# Altium schematic sheet RIGHT.SchDoc
size A4; SheetNumber: 3; SheetTotal: 7
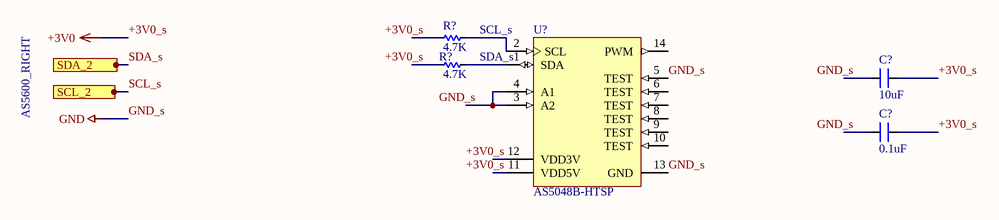
[diagram p0: RIGHT.SchDoc]

## Parts
(Parts that share a designator on the sheet are numbered #1, #2 ... from top to bottom, then left to right.)
C?#1  10uF  [C-SE-7,5x10x9x5x4]
C?#2  0.1uF  [C-SE-7,5x10x9x5x4]
R?#1  4.7K  [RES-1/2W]
R?#2  4.7K  [RES-1/2W]
U?  AS5048B-HTSP  [AMS-TSSOP-14-5000X4400DE_N]

## Ports
SCL_2, SDA_2

## Nets
+3V0_s: C?#1.2 C?#2.2  [also labelled +3V0]
GND_s: U?.5(TEST) U?.13(GND)  [also labelled GND]
SCL_s: port SCL_2
SDA_s: port SDA_2
NetR?#1_1: R?#1.1 U?.2(SCL)
NetR?#2_1: R?#2.1 U?.1(SDA)
NetU?_3: U?.3(A2) U?.4(A1)

Not connected (* = marked no-connect by the designer): C?#1 1; C?#2 1; R?#1 2; R?#2 2; U? 6(TEST) 7(TEST) 8(TEST) 9(TEST) 10(TEST) 11(VDD5V) 12(VDD3V) 14(PWM)

## Notes on the sheet
- SCL_s
- AS5600_RIGHT
- (near R?#2) SDA_s
- Labels drawn without touching a wire or pin: +3V0_s, GND_s

## Library data of the parts
C?#1 C?#2 = CN-SEMI-DIP: Capacitor (Semiconductor SIM Model); Value: 104; LatestRevisionDate: 17-Jul-2002; LatestRevisionNote: Re-released for DXP Platform.; PackageReference: C1206; Publisher: Altium Limited
R?#1 R?#2 = Res: Manufacturer: Generic Components; Class: Passive; SubClass: R; Published: 08/06/2000; Publisher: Altium Hobart Technology Centre
U? = CMP-0555-00031-2: Magnetic Rotary Encoder 14-bit Angular Position Sensor, 3.3 or 5 V, TSSOP-14, Pb-Free, Reel; Manufacturer: AMS; Supply Voltage (V): 3.3 or 5.0; Output: IÂ²C, PWM; PackageDescription: 14-Pin Small Outline Package, 5 x 4.4 mm Body, 0.65 mm Pitch; Mounting Technology: Surface Mount; ComponentLink2URL: http://www.ams.com/eng/content/download/438523/1341157/143016; ComponentLink2Description: Datasheet; PackageReference: TSSOP-14; Features: IÂ²C, PWM, In System Programmable; PackageVersion: Rev. 2.7, 10/2010; Code_JEDEC: MO-153; DatasheetVersion: Rev. 1.3; Resolution: 14-bit; PartNumber: AS5048B-HTSP; ComponentLink1Description: Manufacturer URL; ComponentLink1URL: www.ams.com